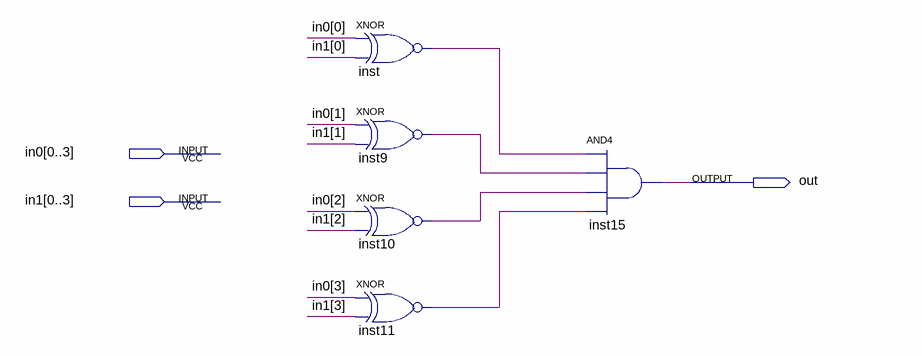
[diagram p0: schematic sheet]
// Quartus schematic EqualsNumber.bdf as structural Verilog: 5 symbols, 3 pins
module EqualsNumber (
  input  [0:3] in0,
  input  [0:3] in1,
  output out
);

  wire inst9_out, inst10_out, inst11_out, inst_out;

  xnor inst (inst_out, in0[0], in1[0]);
  xnor inst9 (inst9_out, in0[1], in1[1]);
  xnor inst10 (inst10_out, in0[2], in1[2]);
  xnor inst11 (inst11_out, in0[3], in1[3]);
  and inst15 (out, inst_out, inst9_out, inst10_out, inst11_out);
endmodule
